# EasyEDA Pro project usbhub.epro

# Schematic Schematic2
Board Name: Board2; Create Date: 2026-05-03; Page Name: P1; Project Name: USB HUB; Schematic Name: Schematic2; Update Date: 2026-05-03; Company: EasyEDA.com; Page Size: A4; Version: V1.0
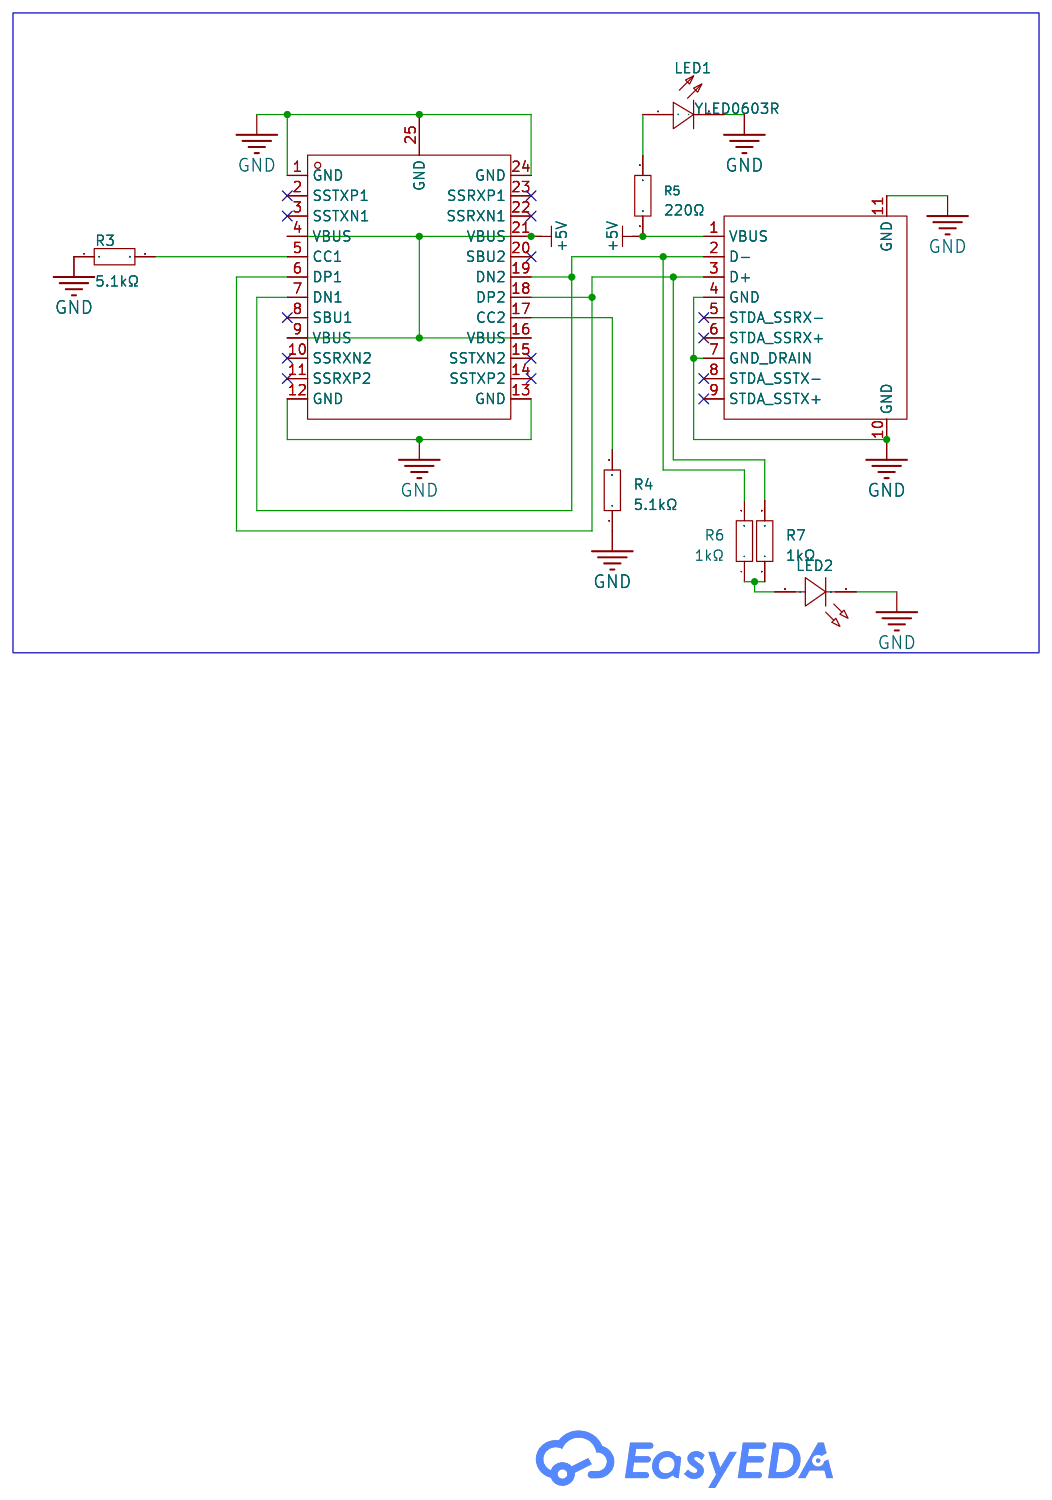
[diagram p0: schematic sheet]

## Parts
LED1  YLED0603R  [LED0603-FD]
LED2  YLED0603Y  [LED0603-RD-1]
R3  5.1kΩ  [R0603]
R4  5.1kΩ  [R0603]
R5  220Ω  [R0603]
R6  1kΩ  [R0402]
R7  1kΩ  [R0402]
U2  HC-USB3.0-C26  [USB-3.0-A-SMD_HC-USB3.0-C26]
USB8  TYPE-C-31-G-08  [USB-C-SMD_TYPE-C-31-G-08]

## Library data of the parts
LED1 = YLED0603R: Lamp Holder Type:-；- Illumination Color:Red Voltage - Forward(Vf):1.8V~2.4V Voltage - Forward(Vf):1.8V~2.4V Power(Watts):- Forward Current:25mA Wavelength - Dominant:620nm~625nm Wavelength - Dominant:620nm~625nm Peak Wavelength:- Diode Configuration:Discr; LCSC Part Name: 红色 独立二极管; Supplier Part: C19171390; Manufacturer: YONGYUTAI(永裕泰); Supplier Footprint: 0603; JLCPCB Part Class: Extended Part; Datasheet: https://item.szlcsc.com/datasheet/YLED0603R/20382441.html; Supplier: LCSC; Lamp Holder Type: -；-; Illumination Color: Red; Voltage - Forward(Vf): 1.8V~2.4V; Forward Current: 25mA; Wavelength - Dominant: 620nm~625nm; Diode Configuration: Discrete Diode; Luminous Intensity: 120mcd; Viewing Angle: 120°; Operating Temperature: -40℃~+85℃
LED2 = YLED0603Y: Lamp Holder Type:- Illumination Color:Yellow Voltage - Forward(Vf):1.8V~2.4V Voltage - Forward(Vf):1.8V~2.4V Power(Watts):- Forward Current:30mA Wavelength - Dominant:585nm~595nm Wavelength - Dominant:585nm~595nm Peak Wavelength:- Diode Configuration:Disc; LCSC Part Name: 黄色 独立二极管; Supplier Part: C19273152; Manufacturer: YONGYUTAI(永裕泰); Supplier Footprint: 0603; JLCPCB Part Class: Extended Part; Datasheet: https://item.szlcsc.com/datasheet/YLED0603Y/20555406.html; Supplier: LCSC; Illumination Color: Yellow; Voltage - Forward(Vf): 1.8V~2.4V; Forward Current: 30mA; Wavelength - Dominant: 585nm~595nm; Diode Configuration: Discrete Diode; Luminous Intensity: 144mcd; Viewing Angle: 120°; Operating Temperature: -40℃~+85℃
R3 R4 = HoAR0603-1/10W-5.1KR-0.1%-TCR25: Type:Ceramic resistor Resistance:5.1kΩ Tolerance:±0.1% Tolerance:±0.1% Power(Watts):1/10W Temperature Coefficient:±25ppm/℃ Temperature Coefficient:±25ppm/℃; LCSC Part Name: 陶瓷电阻 5.1kΩ ±0.1% 100mW; Supplier Part: C5123587; Manufacturer: Milliohm(毫欧); Supplier Footprint: 0603; JLCPCB Part Class: Extended Part; Datasheet: https://item.szlcsc.com/datasheet/HoAR0603-1%252F10W-5.1KR-0.1%2525-TCR25/5717802.html; Supplier: LCSC; Type: Ceramic resistor; Tolerance: ±0.1%; Power(Watts): 1/10W; Temperature Coefficient: ±25ppm/℃
R5 = 0603WAF2200T5E: Type:Thick Film Resistors Resistance: Tolerance:±1% Tolerance:±1% Power(Watts): Overload Voltage (Max): Temperature Coefficient:±100ppm/℃ Temperature Coefficient:±100ppm/℃ Operating Temperature Range:-55℃~+155℃ Operating Temperature Range:-55℃~+155℃; LCSC Part Name: 220Ω ±1% 100mW 厚膜电阻; Supplier Part: C22962; Manufacturer: UNI-ROYAL(厚声); Supplier Footprint: 0603; JLCPCB Part Class: Basic Part; Datasheet: https://atta.szlcsc.com/upload/public/pdf/source/20200306/C422600_1E6D84923E4A46A82E41ADD87F860B5C.pdf; Supplier: LCSC; Type: Thick Film Resistors; Tolerance: ±1%; Temperature Coefficient: ±100ppm/℃; Operating Temperature Range: -55℃~+155℃
R6 R7 = RC0402FR-071KL: Type:Thick Film Resistor Resistance:1kΩ Tolerance:±1% Tolerance:±1% Power(Watts):62.5mW Voltage-Supply(Max):50V Temperature Coefficient:±100ppm/℃ Temperature Coefficient:±100ppm/℃ Operating Temperature:-55℃~+155℃ Operating Temperature:-55℃~+155℃; LCSC Part Name: 厚膜电阻 1kΩ ±1% 62.5mW; Supplier Part: C106235; Manufacturer: YAGEO(国巨); Supplier Footprint: 0402; JLCPCB Part Class: Extended Part; Datasheet: https://item.szlcsc.com/datasheet/RC0402FR-071KL/107450.html; Supplier: LCSC; Type: Thick Film Resistor; Tolerance: ±1%; Power(Watts): 62.5mW; Voltage-Supply(Max): 50V; Temperature Coefficient: ±100ppm/℃; Operating Temperature: -55℃~+155℃
U2 = HC-USB3.0-C26: Connector Type:Type-A Protocol Standard:USB 3.0 Gender:Male Mounting Type:Recessed Mount Number of Contacts:9P Number of Ports:1 Current Rating-Power:1.5A Voltage Rating:30V Connect-Disconnect Life:1,500 Cycles Supplementary Features:- Center Height:- Len; LCSC Part Name: Type-A 公 沉板 USB3.0 A公沉板2.6 直脚中针蓝色 无柱; Supplier Part: C7501854; Manufacturer: HC(虹成电子); Supplier Footprint: SMD; JLCPCB Part Class: Extended Part; Datasheet: https://item.szlcsc.com/datasheet/HC-USB3.0-C26/8585395.html; Supplier: LCSC; Connector Type: Type-A; Protocol Standard: USB 3.0; Gender: Male; Mounting Type: Recessed Mount; Number of Contacts: 9P; Number of Ports: 1; Current Rating-Power: 1.5A; Voltage Rating: 30V; Connect-Disconnect Life: 1,500 Cycles; Length: 18.9mm; Detection color: Blue; Operating Temperature: -25℃~+70℃
USB8 = TYPE-C-31-G-08: Connector Type:Type-C Protocol Standard:- Gender:Male Mounting Type:Laminated board Number of Contacts:24P Number of Ports:1 Current Rating-Power:5A Voltage Rating:5V Connect-Disconnect Life:10,000 cycles Length:15.5mm Detection color:Black Operating Temp; LCSC Part Name: Type-C 公 沉板; Supplier Part: C2909200; Manufacturer: 韩国韩荣; Supplier Footprint: SMD; JLCPCB Part Class: Extended Part; Datasheet: https://item.szlcsc.com/datasheet/TYPE-C-31-G-08/3185965.html; Supplier: LCSC; Connector Type: Type-C; Gender: Male; Mounting Type: Laminated board; Number of Contacts: 24P; Number of Ports: 1; Current Rating-Power: 5A; Voltage Rating: 5V; Connect-Disconnect Life: 10,000 cycles; Length: 15.5mm; Detection color: Black; Operating Temperature: -40℃~+85℃

## Nets
+5V: R5.1 U2.1(VBUS) USB8.4(VBUS) USB8.9(VBUS) USB8.16(VBUS) USB8.21(VBUS)
GND: LED1.2(-) LED2.1(C) R3.1 R4.1 U2.4(GND) U2.7(GND_DRAIN) U2.10(GND) U2.11(GND) USB8.1(GND) USB8.12(GND) USB8.13(GND) USB8.24(GND) USB8.25(GND)
$1N407: R7.2 U2.3(D+) USB8.6(DP1) USB8.18(DP2)
$1N420: R6.2 U2.2(D-) USB8.7(DN1) USB8.19(DN2)
$1N436: R4.2 USB8.17(CC2)
$1N440: R3.2 USB8.5(CC1)
$1N565: LED1.1(+) R5.2
$1N805: LED2.2(A) R6.1 R7.1

Not connected (* = marked no-connect by the designer): U2 5(STDA_SSRX-)* 6(STDA_SSRX+)* 8(STDA_SSTX-)* 9(STDA_SSTX+)*; USB8 2(SSTXP1)* 3(SSTXN1)* 8(SBU1)* 10(SSRXN2)* 11(SSRXP2)* 14(SSTXP2)* 15(SSTXN2)* 20(SBU2)* 22(SSRXN1)* 23(SSRXP1)*

# Schematic Schematic1
Board Name: Board1; Create Date: 2026-05-03; Page Name: P1; Project Name: USB HUB; Schematic Name: Schematic1; Update Date: 2026-05-30; Company: EasyEDA.com; Page Size: A4; Version: V1.0
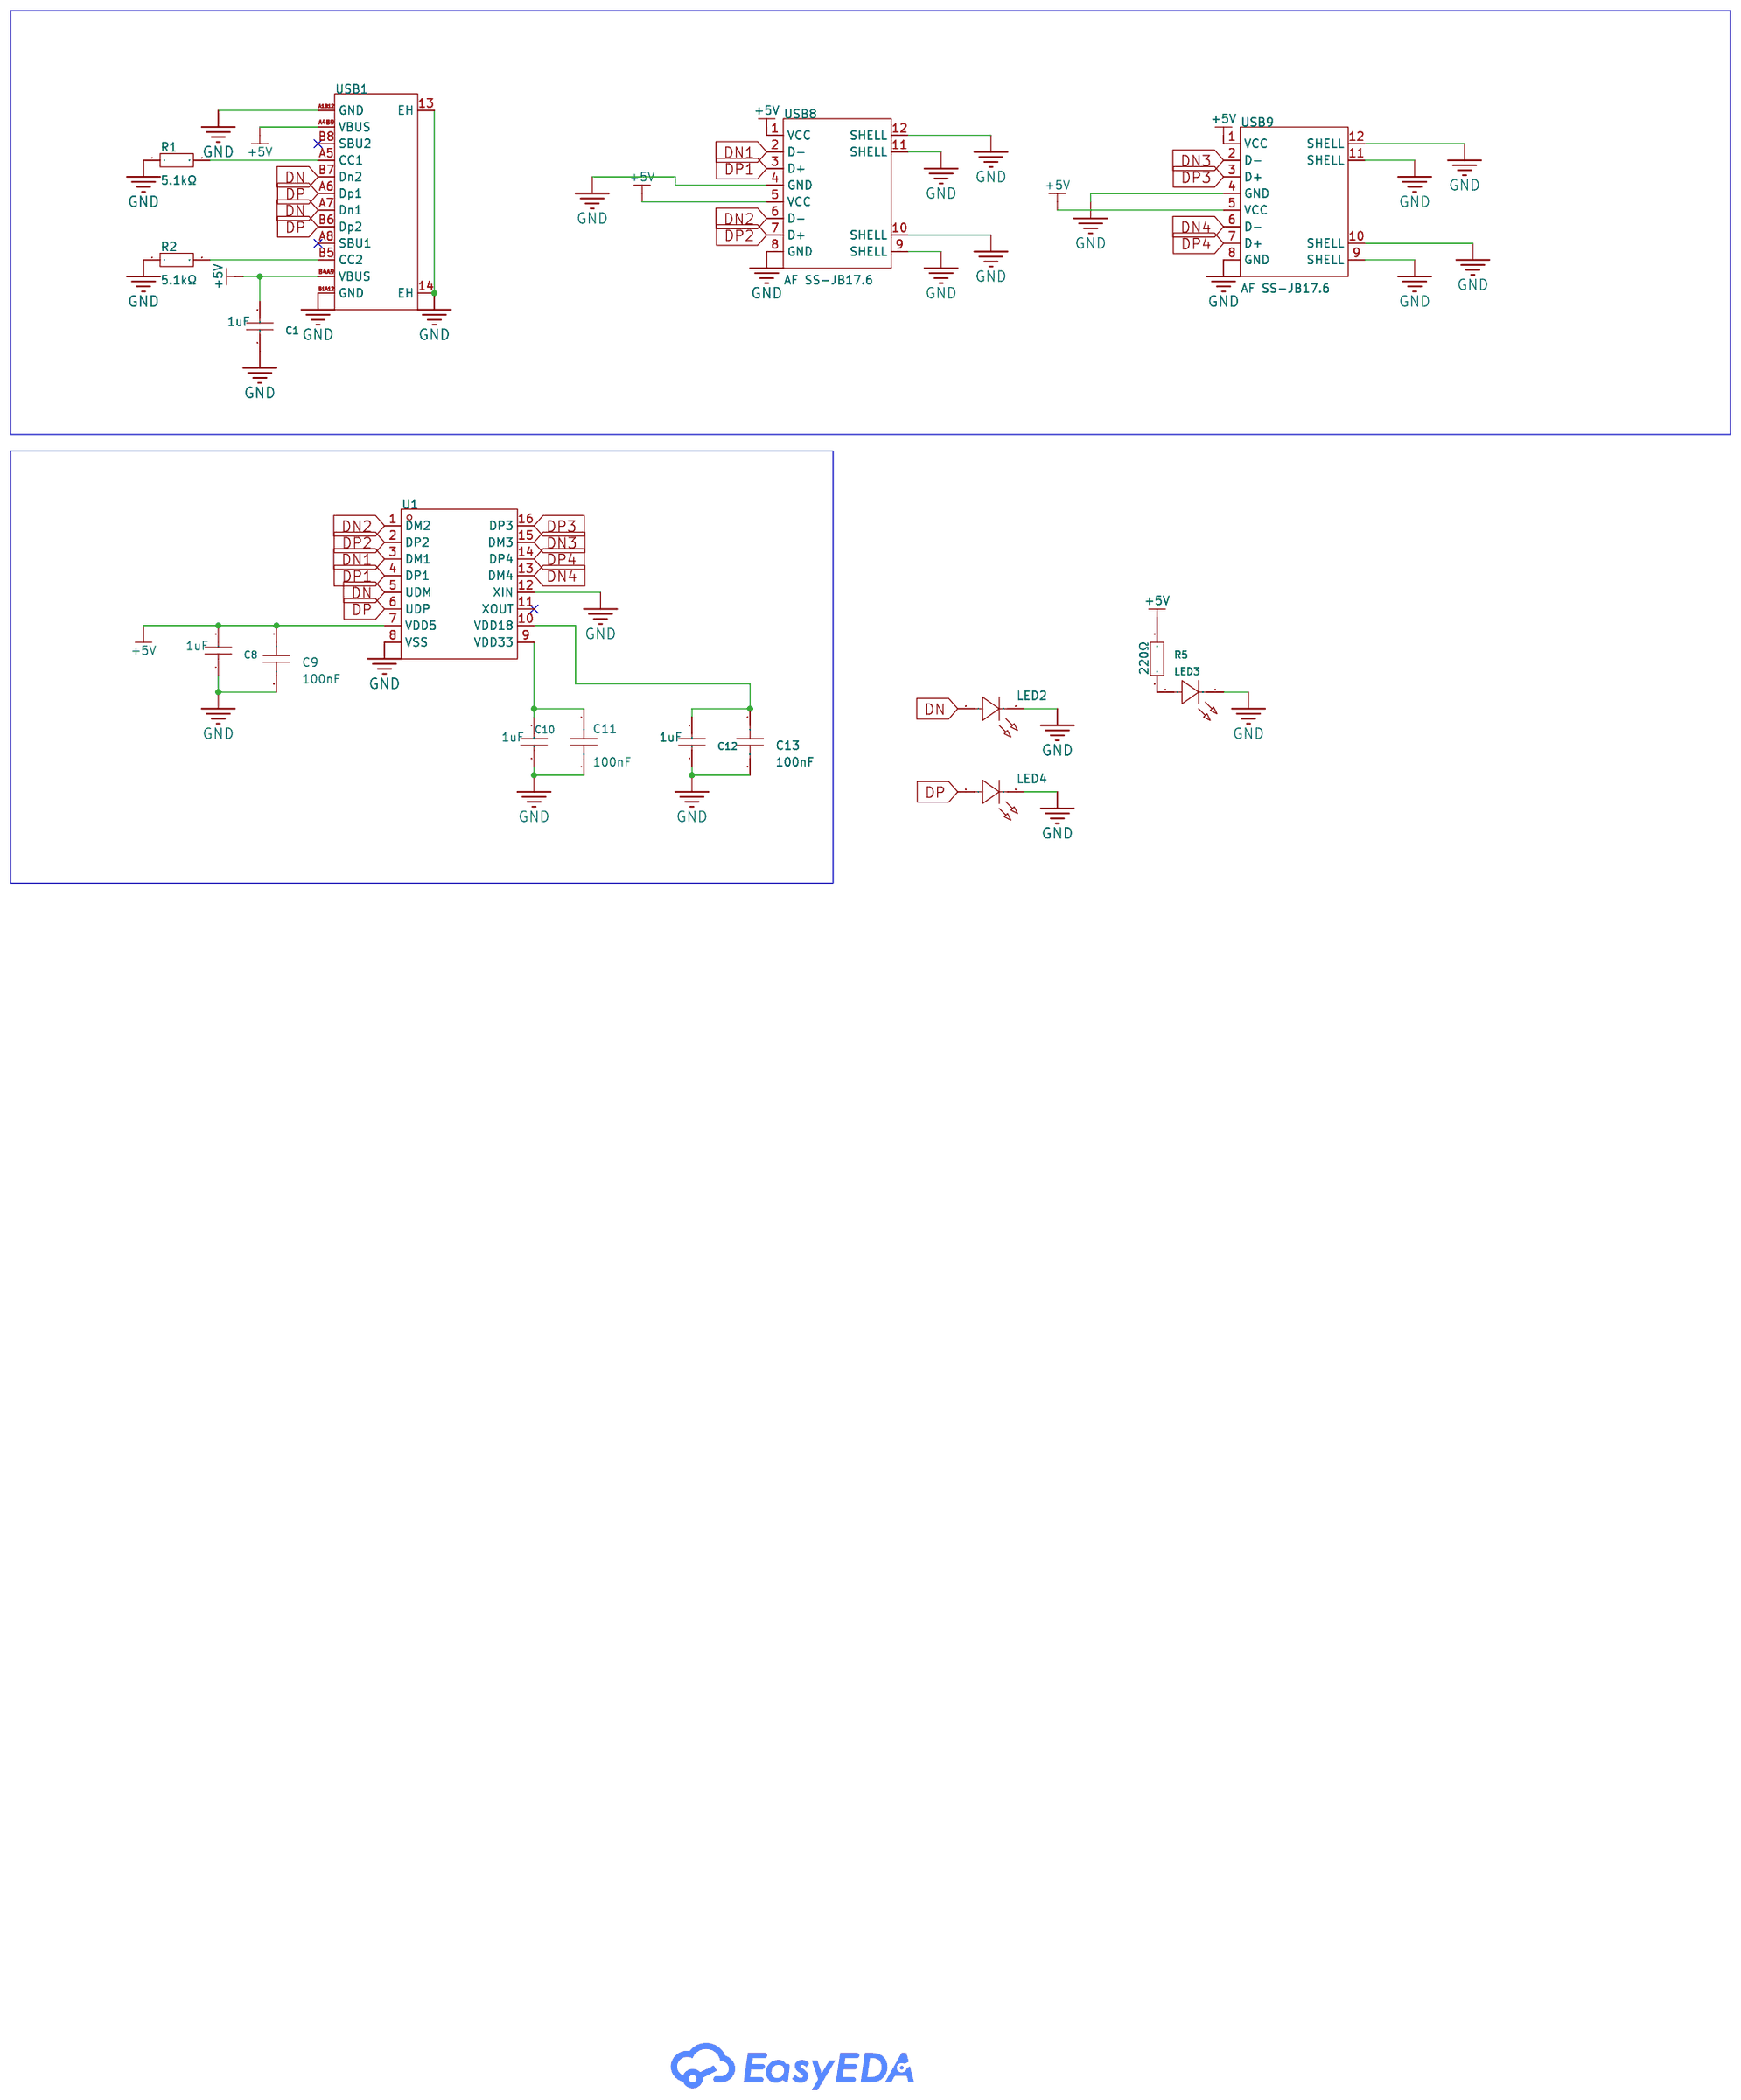
[diagram p1: schematic sheet]

## Parts
C1  1uF  [C0805]
C8  1uF  [C0805]
C9  100nF  [C0603]
C10  1uF  [C0805]
C11  100nF  [C0603]
C12  1uF  [C0805]
C13  100nF  [C0603]
LED2  YLED0603Y  [LED0603-RD-1]
LED3  XL-1608UGC-04  [LED0603-RD_GREEN]
LED4  YLED0603Y  [LED0603-RD-1]
R1  5.1kΩ  [R0603]
R2  5.1kΩ  [R0603]
R5  220Ω  [R0603]
U1  SL2.1s  [SSOP-16_L4.6-W2.6-P0.53-LS4.0-BL]
USB1  TYPE-C 16PIN 2MD(073)  [USB-C-SMD_TYPE-C-16PIN-2MD-073]
USB8  AF SS-JB17.6  [USB-A-TH_AF-SS-JB17.6]
USB9  AF SS-JB17.6  [USB-A-TH_AF-SS-JB17.6]

## Library data of the parts
C1 C8 C10 C12 = CL21B105KBFNNNE: Capacitance:1uF Tolerance:±10% Tolerance:±10% Voltage Rating:50V Temperature Coefficient:X7R; LCSC Part Name: 1uF ±10% 50V; Supplier Part: C28323; Manufacturer: SAMSUNG(三星); Supplier Footprint: 0805; JLCPCB Part Class: Basic Part; Datasheet: https://item.szlcsc.com/datasheet/CL21B105KBFNNNE/29074.html; Supplier: LCSC; Tolerance: ±10%; Voltage Rating: 50V; Temperature Coefficient: X7R
C9 C11 C13 = CC0603KRX7R9BB104: Capacitance:100nF Tolerance:±10% Tolerance:±10% Voltage Rating:50V Temperature Coefficient:X7R; LCSC Part Name: 100nF ±10% 50V; Supplier Part: C14663; Manufacturer: YAGEO(国巨); Supplier Footprint: 0603; JLCPCB Part Class: Basic Part; Datasheet: https://item.szlcsc.com/datasheet/CC0603KRX7R9BB104/15331.html; Supplier: LCSC; Tolerance: ±10%; Voltage Rating: 50V; Temperature Coefficient: X7R
LED2 LED4 = YLED0603Y: Lamp Holder Type:- Illumination Color:Yellow Voltage - Forward(Vf):1.8V~2.4V Voltage - Forward(Vf):1.8V~2.4V Power(Watts):- Forward Current:30mA Wavelength - Dominant:585nm~595nm Wavelength - Dominant:585nm~595nm Peak Wavelength:- Diode Configuration:Disc; LCSC Part Name: 黄色 独立二极管; Supplier Part: C19273152; Manufacturer: YONGYUTAI(永裕泰); Supplier Footprint: 0603; JLCPCB Part Class: Extended Part; Datasheet: https://item.szlcsc.com/datasheet/YLED0603Y/20555406.html; Supplier: LCSC; Illumination Color: Yellow; Voltage - Forward(Vf): 1.8V~2.4V; Forward Current: 30mA; Wavelength - Dominant: 585nm~595nm; Diode Configuration: Discrete Diode; Luminous Intensity: 144mcd; Viewing Angle: 120°; Operating Temperature: -40℃~+85℃
LED3 = XL-1608UGC-04: Lamp Holder Type:- Illumination Color:Emerald Green Voltage - Forward(Vf):3.3V Voltage - Forward(Vf):3.3V Power(Watts):70mW Forward Current:20mA Wavelength - Dominant:515nm~535nm Wavelength - Dominant:515nm~535nm Peak Wavelength:525nm Diode Configuration:; LCSC Part Name: 0603翠绿贴片式发光二极管; Supplier Part: C965804; Manufacturer: XINGLIGHT(成兴光); Supplier Footprint: 0603; JLCPCB Part Class: Extended Part; Datasheet: https://item.szlcsc.com/datasheet/XL-1608UGC-04/1051413.html; Supplier: LCSC; Illumination Color: Emerald Green; Voltage - Forward(Vf): 3.3V; Power(Watts): 70mW; Forward Current: 20mA; Wavelength - Dominant: 515nm~535nm; Peak Wavelength: 525nm; Diode Configuration: Discrete Diode; Lens Color: Water Clear; Luminous Intensity: 810mcd; Viewing Angle: 120°; Mounting Style: Top-mount; Operating Temperature: -40℃~+85℃
R1 R2 = HoAR0603-1/10W-5.1KR-0.1%-TCR25: Type:Ceramic resistor Resistance:5.1kΩ Tolerance:±0.1% Tolerance:±0.1% Power(Watts):1/10W Temperature Coefficient:±25ppm/℃ Temperature Coefficient:±25ppm/℃; LCSC Part Name: 陶瓷电阻 5.1kΩ ±0.1% 100mW; Supplier Part: C5123587; Manufacturer: Milliohm(毫欧); Supplier Footprint: 0603; JLCPCB Part Class: Extended Part; Datasheet: https://item.szlcsc.com/datasheet/HoAR0603-1%252F10W-5.1KR-0.1%2525-TCR25/5717802.html; Supplier: LCSC; Type: Ceramic resistor; Tolerance: ±0.1%; Power(Watts): 1/10W; Temperature Coefficient: ±25ppm/℃
R5 = 0603WAF2200T5E: Type:Thick Film Resistors Resistance: Tolerance:±1% Tolerance:±1% Power(Watts): Overload Voltage (Max): Temperature Coefficient:±100ppm/℃ Temperature Coefficient:±100ppm/℃ Operating Temperature Range:-55℃~+155℃ Operating Temperature Range:-55℃~+155℃; LCSC Part Name: 220Ω ±1% 100mW 厚膜电阻; Supplier Part: C22962; Manufacturer: UNI-ROYAL(厚声); Supplier Footprint: 0603; JLCPCB Part Class: Basic Part; Datasheet: https://atta.szlcsc.com/upload/public/pdf/source/20200306/C422600_1E6D84923E4A46A82E41ADD87F860B5C.pdf; Supplier: LCSC; Type: Thick Film Resistors; Tolerance: ±1%; Temperature Coefficient: ±100ppm/℃; Operating Temperature Range: -55℃~+155℃
U1 = SL2.1s: type:Hub USB Protocol:USB 2.0 Data Rate:- Voltage - Supply:4V~5.25V Voltage - Supply:4V~5.25V Operating Temperature:0℃~+70℃ Operating Temperature:0℃~+70℃ Memory Interface:- Current - Supply:120mA Quiescent Supply Current:2.5mA Number of Channels:4; LCSC Part Name: USB2.0 HUB控制器集成电路; Supplier Part: C2684433; Manufacturer: CoreChips(和芯润德); Supplier Footprint: SSOP-16; JLCPCB Part Class: Extended Part; Datasheet: https://item.szlcsc.com/datasheet/SL2.1s/2782346.html; Supplier: LCSC; type: Hub; USB Protocol: USB 2.0; Voltage - Supply: 4V~5.25V; Operating Temperature: 0℃~+70℃; Current - Supply: 120mA; Quiescent Supply Current: 2.5mA; Number of Channels: 4
USB1 = TYPE-C 16PIN 2MD(073): Connector Type:Type-C Protocol Standard:- Gender:Female Mounting Type:Surface Mount, Right Angle Number of Contacts:16P Number of Ports:1 Current Rating-Power:3A Voltage Rating:5V Connect-Disconnect Life:10,000 Cycles Supplementary Features:- Center Heigh; LCSC Part Name: Type-C 母 卧贴; Supplier Part: C2765186; Manufacturer: SHOU HAN(首韩); Supplier Footprint: SMD; JLCPCB Part Class: Extended Part; Datasheet: https://item.szlcsc.com/datasheet/TYPE-C%252016PIN%25202MD(073)/2901843.html; Supplier: LCSC; Connector Type: Type-C; Gender: Female; Mounting Type: Surface Mount, Right Angle; Number of Contacts: 16P; Number of Ports: 1; Current Rating-Power: 3A; Voltage Rating: 5V; Connect-Disconnect Life: 10,000 Cycles; Detection color: Black; Operating Temperature: -25℃~+85℃
USB8 USB9 = AF SS-JB17.6: Connector Type:Type-A Protocol Standard:USB 2.0 Gender:Female Mounting Type:Right Angle Number of Contacts:4Px2 Number of Ports:2 Current Rating-Power:1.5A Voltage Rating:30V Connect-Disconnect Life:5,000 times Supplementary Features:- Center Height:- Len; LCSC Part Name: Type-A弯插双层母座; Supplier Part: C456021; Manufacturer: SHOU HAN(首韩); Supplier Footprint: 弯插; JLCPCB Part Class: Extended Part; Datasheet: https://item.szlcsc.com/datasheet/AF%2520SS-JB17.6/458828.html; Supplier: LCSC; Connector Type: Type-A; Protocol Standard: USB 2.0; Gender: Female; Mounting Type: Right Angle; Number of Contacts: 4Px2; Number of Ports: 2; Current Rating-Power: 1.5A; Voltage Rating: 30V; Connect-Disconnect Life: 5,000 times; Length: 17.6mm; Detection color: White; Operating Temperature: -25℃~+85℃

## Nets
+5V: C1.2 C8.2 C9.1 R5.2 U1.7(VDD5) USB1.A4B9(VBUS) USB1.B4A9(VBUS) USB8.1(VCC) USB8.5(VCC) USB9.1(VCC) USB9.5(VCC)
GND: C1.1 C8.1 C9.2 C10.1 C11.2 C12.1 C13.2 LED2.1(C) LED3.1(K) LED4.1(C) R1.1 R2.1 U1.8(VSS) U1.12(XIN) USB1.13(EH) USB1.14(EH) USB1.A1B12(GND) USB1.B1A12(GND) USB8.4(GND) USB8.8(GND) USB8.9(SHELL) USB8.10(SHELL) USB8.11(SHELL) USB8.12(SHELL) USB9.4(GND) USB9.8(GND) USB9.9(SHELL) USB9.10(SHELL) USB9.11(SHELL) USB9.12(SHELL)
DN: LED2.2(A) U1.5(UDM) USB1.A7(Dn1) USB1.B7(Dn2)
DN1: U1.3(DM1) USB8.2(D-)
DN2: U1.1(DM2) USB8.6(D-)
DN3: U1.15(DM3) USB9.2(D-)
DN4: U1.13(DM4) USB9.6(D-)
DP: LED4.2(A) U1.6(UDP) USB1.A6(Dp1) USB1.B6(Dp2)
DP1: U1.4(DP1) USB8.3(D+)
DP2: U1.2(DP2) USB8.7(D+)
DP3: U1.16(DP3) USB9.3(D+)
DP4: U1.14(DP4) USB9.7(D+)
$1N863: R1.2 USB1.A5(CC1)
$1N889: R2.2 USB1.B5(CC2)
$1N3801: C10.2 C11.1 U1.9(VDD33)
$1N3815: C12.2 C13.1 U1.10(VDD18)
$1N6307: LED3.2(A) R5.1

Not connected (* = marked no-connect by the designer): U1 11(XOUT)*; USB1 A8(SBU1)* B8(SBU2)*

# Board PCB3
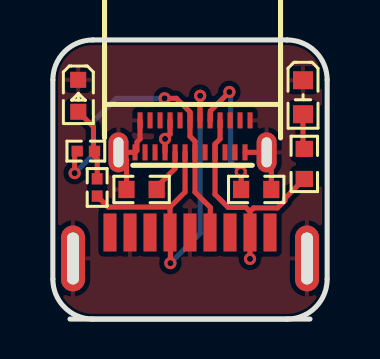
[diagram p2: board, top side]
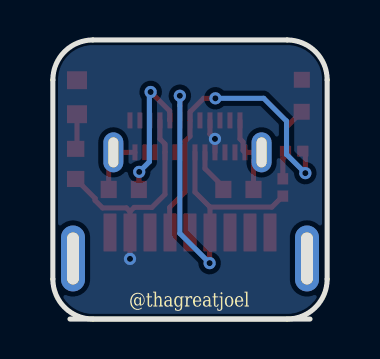
[diagram p3: board, bottom side, seen from below]

Outline 13.72 x 13.97 mm; copper layers: Top Layer, Bottom Layer. Coordinates in mm from the lower left corner of the outline.
Outline path: 0,11.97 0,2 arc(0.59,0.59) 2,0 11.72,0 arc(13.13,0.59) 13.72,2 13.72,11.97 arc(13.13,13.38) 11.72,13.97 2,13.97 arc(0.59,13.38) 0,11.97
Stack: Top Layer 0.035mm / Dielectric1 1.51mm FR4 er 4.5 / Bottom Layer 0.035mm

## Design rules (mm)
template: JLCPCB Capability(Two Layers Board)
spacing copperThickness1oz (default): track to track 0.102, other pairs 0.152 to 0.3
spacing copperThickness2oz: track to track 0.203, other pairs 0.152 to 0.3
track width copperThickness1oz (default): min 0.127, default 0.254, max 2.54
track width copperThickness2oz: min 0.203, default 0.254, max 2.54
differential pair differentialPair (default): width min 0.127, default 0.254, max 2.54; gap min 0.152, default 0.152
via viaSize (default): diameter min 0.5, default 0.61, max 10; hole min 0.3, default 0.305, max 6.3

## Placement (name value [footprint] x y rotation side)
LED1  YLED0603R  [LED0603-FD]  12.51 11.1 90 top
LED2  YLED0603Y  [LED0603-RD-1]  1.27 11.18 270 top
R3  5.1kΩ  [R0603]  4.44 6.49 0 top
R4  5.1kΩ  [R0603]  10.17 6.49 180 top
R5  220Ω  [R0603]  12.57 7.76 90 top
R6  1kΩ  [R0402]  1.65 8.41 180 top
R7  1kΩ  [R0402]  2.22 6.59 270 top
U2  HC-USB3.0-C26  [USB-3.0-A-SMD_HC-USB3.0-C26]  6.86 3.68 0 top
USB8  TYPE-C-31-G-08  [USB-C-SMD_TYPE-C-31-G-08]  6.98 9.14 180 top

## Footprints (pads in the part's own frame, mm; a bottom-side part is the same pattern mirrored in y, then rotated)
LED0603-FD
  rect 0.9x1 smd: 1(-0.85,0) 2(0.85,0)
LED0603-RD-1
  rect 0.8x0.8 smd: 1(-0.799,-0.004) 2(0.799,0.004)
R0402
  rect 0.566x0.54 smd: 1(-0.433,0) 2(0.433,0)
R0603
  rect 0.806x0.864 smd: 1(-0.753,0) 2(0.753,0)
USB-3.0-A-SMD_HC-USB3.0-C26
  rect 0.65x1.9 smd: 1(3,0.65) 2(1,0.65) 3(-1,0.65) 4(-3,0.65) 5(-4,0.65) 6(-2,0.65) 7(0,0.65) 8(2,0.65) 9(4,0.65)
  oval 1.2x3.3 hole 0.6x2.6: 10(-5.85,-0.65) 11(5.85,-0.65)
USB-C-SMD_TYPE-C-31-G-08
  rect 0.25x0.8 smd: 1(2.875,0.8) 2(2.375,0.8) 3(1.875,0.8) 4(1.375,0.8) 5(0.875,0.8) 6(0.375,0.8) 7(-0.125,0.8) 8(-0.625,0.8) 9(-1.125,0.8) 10(-1.625,0.8) 11(-2.125,0.8) 12(-2.625,0.8) 13(-2.875,-0.8) 14(-2.375,-0.8) 15(-1.875,-0.8) 16(-1.375,-0.8) 17(-0.875,-0.8) 18(-0.375,-0.8) 19(0.125,-0.8) 20(0.625,-0.8) 21(1.125,-0.8) 22(1.625,-0.8) 23(2.125,-0.8) 24(2.625,-0.8)
  oval 1x2 hole 0.5x1.5: 25(-3.705,0.8) 25(3.705,0.8)

## Nets
As in the schematic.

Pads without a net: U2 5 6 8 9; USB8 2 3 8 10 11 14 15 20 22 23

## Via types
v1: diameter 0.61, hole 0.305, Top Layer to Bottom Layer, 8 vias

## Routing (per net, layer and track width the routed paths; a pad name or vN(x,y) marks a point on that pad's centre or on a via; arc(x,y) is an arc through that point)
+5V: length 13.4
  Top Layer w0.254: 9.86,5.38 10.04,5.56 11.23,5.56 11.6,5.94 11.6,6.04 R5.1 ; 9.86,5.38 9.65,5.59 8.76,5.59 8.11,6.24 USB8.9 8.11,8.76 8.36,9.01 USB8.16 ; 9.86,5.38 v1(9.86,3.01) ; USB8.4 v1(5.61,9.02) 5.85,9.25 5.86,9.25 USB8.21
GND: length 7.6
  Top Layer w0.254: USB8.24 4.36,9.01 4.21,8.86 4.21,8.44 USB8.1 USB8.25 3.68,7.94 R3.1 ; R4.1 10.92,8.11 USB8.25 USB8.12
$1N407: length 20
  Top Layer w0.254: 5.86,5.6 2.77,5.6 2.22,6.15 ; 5.86,5.6 6.61,6.36 USB8.6 ; 5.86,5.6 5.86,4.33 5.88,4.31 v1(5.88,2.8) ; v1(7.37,11.18) 7.37,10.68 7.36,10.67 USB8.18
  Bottom Layer w0.254: v1(5.88,2.8) 7.37,4.29 v1(7.37,11.18)
$1N420: length 16.2
  Top Layer w0.254: v1(1.09,7.3) 1.09,8.28 R6.2 ; v1(5.59,11.05) 6.17,11.05 6.86,10.36 USB8.19 6.86,9.94 6.86,9.14 7.11,8.89 USB8.7 7.11,6.35 7.87,5.59 7.87,4.35 7.86,4.33
  Bottom Layer w0.254: v1(1.09,7.3) 2.03,8.24 2.03,9.91 3.17,11.05 v1(5.59,11.05)
$1N436: length 6.9
  Top Layer w0.254: v1(9.4,7.37) 9.42,7.35 R4.2 ; USB8.17 7.87,9.96 7.87,10.41 v1(8.83,11.37)
  Bottom Layer w0.254: v1(8.83,11.37) 8.89,11.3 8.89,7.87 v1(9.4,7.37)
$1N440: length 2.1
  Top Layer w0.254: 5.19,6.61 6.11,7.53 USB8.5
$1N565: length 1.8
  Top Layer w0.254: R5.2 12.51,8.58 LED1.1
$1N805: length 3.7
  Top Layer w0.254: R7.1 2.22,8.02 2.03,8.2 2.03,9.62 LED2.2

## Copper pours and planes (outline as drawn; the poured copper is in the pictures)
+5V on Bottom Layer: -10.41,15.88 17.4,15.88 17.4,-6.48 -10.41,-6.48
GND on Top Layer: -2.41,19.3 20.07,19.3 20.07,-2.92 -2.41,-2.92

## Text on the board
Bottom Silkscreen Layer: @thagreatjoel

# Board PCB1
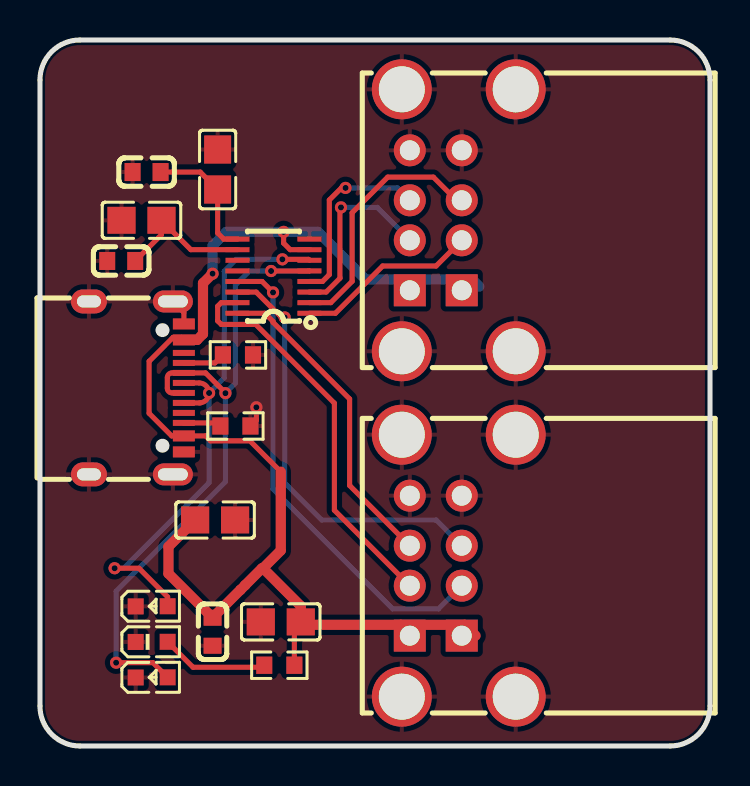
[diagram p4: board, top side]
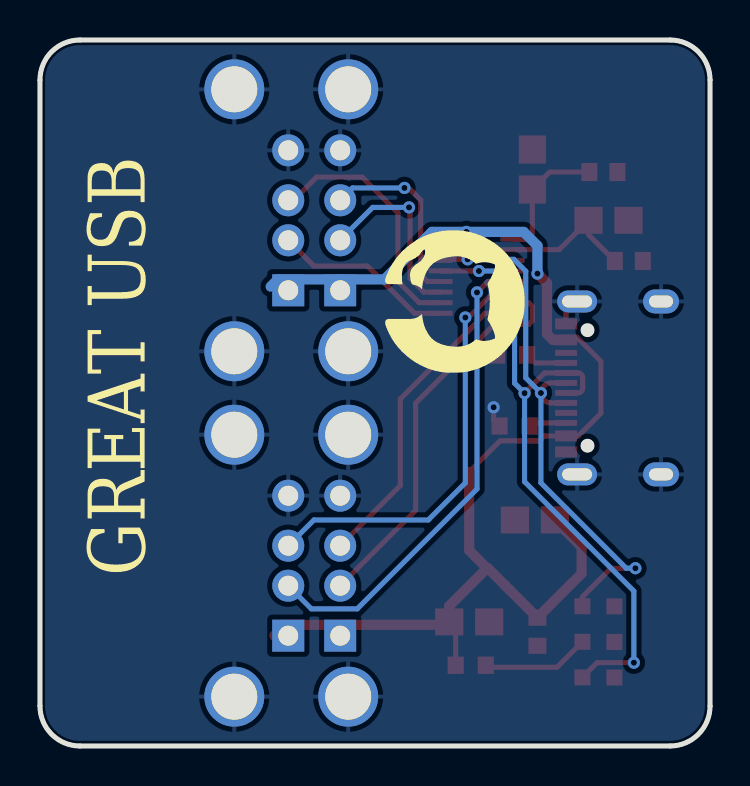
[diagram p5: board, bottom side, seen from below]

Outline 33.53 x 35.31 mm; copper layers: Top Layer, Bottom Layer. Coordinates in mm from the lower left corner of the outline.
Outline path: 0,33.31 0,2 arc(0.59,0.59) 2,0 31.53,0 arc(32.94,0.59) 33.53,2 33.53,33.31 arc(32.94,34.72) 31.53,35.31 2,35.31 arc(0.59,34.72) 0,33.31
Stack: Top Layer 0.035mm / Dielectric1 1.51mm FR4 er 4.5 / Bottom Layer 0.035mm

## Design rules (mm)
template: JLCPCB Capability(Two Layers Board)
spacing copperThickness1oz (default): track to track 0.102, other pairs 0.152 to 0.3
spacing copperThickness2oz: track to track 0.203, other pairs 0.152 to 0.3
track width copperThickness1oz (default): min 0.127, default 0.254, max 2.54
track width copperThickness2oz: min 0.203, default 0.254, max 2.54
differential pair differentialPair (default): width min 0.127, default 0.254, max 2.54; gap min 0.152, default 0.152
via viaSize (default): diameter min 0.5, default 0.61, max 10; hole min 0.3, default 0.305, max 6.3

## Placement (name value [footprint] x y rotation side)
C1  1uF  [C0805]  8.76 11.3 180 top
C8  1uF  [C0805]  12.05 6.21 0 top
C9  100nF  [C0603]  8.64 5.72 270 top
C10  1uF  [C0805]  8.89 28.83 270 top
C11  100nF  [C0603]  5.33 28.7 180 top
C12  1uF  [C0805]  5.08 26.29 0 top
C13  100nF  [C0603]  4.06 24.26 180 top
LED2  YLED0603Y  [LED0603-RD-1]  5.59 3.43 0 top
LED3  XL-1608UGC-04  [LED0603-RD_GREEN]  5.59 5.21 0 top
LED4  YLED0603Y  [LED0603-RD-1]  5.59 6.98 0 top
R1  5.1kΩ  [R0603]  9.91 19.56 180 top
R2  5.1kΩ  [R0603]  9.78 16 180 top
R5  220Ω  [R0603]  11.98 4.04 0 top
U1  SL2.1s  [SSOP-16_L4.6-W2.6-P0.53-LS4.0-BL]  11.68 23.5 90 top
USB1  TYPE-C 16PIN 2MD(073)  [USB-C-SMD_TYPE-C-16PIN-2MD-073]  4.83 17.91 270 top
USB8  AF SS-JB17.6  [USB-A-TH_AF-SS-JB17.6]  20.96 26.29 90 top
USB9  AF SS-JB17.6  [USB-A-TH_AF-SS-JB17.6]  20.96 9.02 90 top

## Footprints (pads in the part's own frame, mm; a bottom-side part is the same pattern mirrored in y, then rotated)
C0603
  rect 0.8x0.9 smd: 1(-0.7,0) 2(0.7,0)
C0805
  rect 1.41x1.35 smd: 1(-1,0) 2(1,0)
LED0603-RD-1
  rect 0.8x0.8 smd: 1(-0.799,-0.004) 2(0.799,0.004)
LED0603-RD_GREEN
  rect 0.8x0.8 smd: 1(-0.799,-0.004) 2(0.799,0.004)
R0603
  rect 0.806x0.864 smd: 1(-0.753,0) 2(0.753,0)
SSOP-16_L4.6-W2.6-P0.53-LS4.0-BL
  rect 0.25x1.2 smd: 1(-1.855,-1.8) 2(-1.325,-1.8) 3(-0.795,-1.8) 4(-0.265,-1.8) 5(0.265,-1.8) 6(0.795,-1.8) 7(1.325,-1.8) 8(1.855,-1.8) 9(1.855,1.8) 10(1.325,1.8) 11(0.795,1.8) 12(0.265,1.8) 13(-0.265,1.8) 14(-0.795,1.8) 15(-1.325,1.8) 16(-1.855,1.8)
USB-A-TH_AF-SS-JB17.6
  rect 1.6x1.6 hole 1: 1(-3.5,2.45) 5(-3.5,-0.15)
  round 1.6 hole 1: 2(-1,2.45) 3(1,2.45) 4(3.5,2.45) 6(-1,-0.15) 7(1,-0.15) 8(3.5,-0.15)
  round 3 hole 2.3: 9(-6.55,2.85) 10(6.55,2.85) 11(-6.55,-2.85) 12(6.55,-2.85)
USB-C-SMD_TYPE-C-16PIN-2MD-073
  oval 1.1x2 hole 0.6x1.5: 13(-4.325,1.825) 14(4.325,1.825)
  oval 1.2x1.8 hole 0.6x1.2: 13(-4.325,-2.375) 14(4.325,-2.375)
  rect 0.55x1.1 smd: A1B12(-3.2,2.375) A4B9(-2.4,2.375) B1A12(3.2,2.375) B4A9(2.4,2.375)
  rect 0.3x1.1 smd: A5(-1.25,2.375) A6(-0.25,2.375) A7(0.25,2.375) A8(1.25,2.375) B5(1.75,2.375) B6(0.75,2.375) B7(-0.75,2.375) B8(-1.75,2.375)

## Nets
As in the schematic.

Pads without a net: U1 11; USB1 A8 B8

## Via types
v1: diameter 0.61, hole 0.305, Top Layer to Bottom Layer, 13 vias

## Routing (per net, layer and track width the routed paths; a pad name or vN(x,y) marks a point on that pad's centre or on a via; arc(x,y) is an arc through that point)
+5V: length 66.3
  Top Layer w0.254: USB1.A4B9 7.07,20.43 6.66,20.43 5.46,19.24 5.46,16.64 6.59,15.51 USB1.B4A9 8.29,15.51 8.54,15.26 10.5,15.26 12.05,13.72 ; v1(12.19,25.71) 12.19,25.15 12.52,24.82 U1.7 ; C8.2 12.73,5.89 R5.2
  Top Layer w0.508: 12.05,13.72 12.05,9.78 11.16,8.89 ; 11.16,8.89 11.11,8.89 10.27,8.05 10.27,8.05 10.03,7.81 10.03,7.81 C9.1 6.43,8.62 6.43,9.97 C1.2 ; 11.16,8.89 13.05,7 C8.2 13.19,6.06 18.05,6.06 ; v1(8.64,23.62) 8.16,23.14 8.16,20.6 7.86,20.31 USB1.A4B9 ; 18.05,6.06 18.6,5.52 ; 18.05,6.06 21.25,6.06 21.8,5.52
  Bottom Layer w0.508: 21.98,22.97 21.62,23.33 18.6,23.33 ; 18.6,23.33 16.29,23.33 13.91,25.71 v1(12.19,25.71) 9.33,25.71 8.64,25.02 v1(8.64,23.62) ; 18.6,23.33 18.6,22.79
GND: length 2.4
  Top Layer w0.254: v1(10.83,16.94) 10.83,16.3 R2.1 ; 6.65,22.23 7.2,21.68 USB1.A1B12
DN: length 33.2
  Top Layer w0.254: LED2.2 5.65,4.17 v1(3.81,4.17) ; U1.5 13.48,23.75 v1(11.56,23.75) ; USB1.A7 6.61,17.66 arc(6.44,17.73) 6.37,17.89 6.37,18.42 arc(6.44,18.59) 6.61,18.66 USB1.B7 8.28,18.66 9.28,17.66 v1(9.28,17.64)
  Bottom Layer w0.254: v1(3.81,4.17) 3.81,7.75 9.28,13.22 v1(9.28,17.64) 9.78,18.14 9.78,23.06 10.47,23.75 v1(11.56,23.75)
DN1: length 9.5
  Top Layer w0.254: U1.3 14.32,22.7 15.01,23.39 15.01,26.78 15.06,26.83 v1(15.06,26.94)
  Bottom Layer w0.254: 18.5,25.29 18.5,25.31 16.88,26.94 v1(15.06,26.94)
DN2: length 9.1
  Top Layer w0.254: USB8.6 19.82,24 17.15,24 14.78,21.64 U1.1
DN3: length 20
  Top Layer w0.254: 18.5,8.02 14.73,11.79 14.73,17.14 10.8,21.08 9.07,21.08 8.89,21.26 8.89,21.99 9.07,22.17 U1.15
DN4: length 24.2
  Top Layer w0.254: U1.13 11.11,23.23 v1(11.66,22.68)
  Bottom Layer w0.254: USB9.6 19.95,6.86 17.65,6.86 11.66,12.85 v1(11.66,22.68)
DP: length 28.7
  Top Layer w0.254: USB1.A6 7.96,18.16 arc(8.31,18.01) v1(8.46,17.65) arc(8.46,17.62) 8.46,17.58 arc(8.32,17.3) 8.04,17.16 arc(8,17.16) 7.97,17.16 USB1.B6 ; v1(12.13,24.34) 13.44,24.34 U1.6 ; v1(3.74,8.89) 4.95,8.89 6.39,7.46 LED4.2
  Bottom Layer w0.254: v1(12.13,24.34) 9.81,24.34 9.22,23.74 9.22,18.41 v1(8.46,17.65) 8.46,13.16 4.19,8.89 v1(3.74,8.89)
DP1: length 9.4
  Top Layer w0.254: v1(15.29,27.91) 15.08,27.91 14.48,27.3 14.48,23.57 14.14,23.23 U1.4
  Bottom Layer w0.254: v1(15.29,27.91) 17.89,27.91 18.5,27.29
DP2: length 12.7
  Top Layer w0.254: U1.2 14.55,22.17 15.62,23.24 15.62,26.67 17.4,28.45 19.69,28.45 20.84,27.29 USB8.7
DP3: length 16
  Top Layer w0.254: 18.5,10.02 15.49,13.03 15.49,17.36 11.66,21.19 11.66,21.23 11.25,21.64 U1.16
DP4: length 21.3
  Top Layer w0.254: U1.14 10.82,22.7 12.09,21.43 v1(12.25,21.43)
  Bottom Layer w0.254: v1(12.25,21.43) 12.25,13.16 14.1,11.3 19.82,11.3 USB9.7
$1N863: length 2.1
  Top Layer w0.254: R1.2 8.75,19.16 USB1.A5
$1N889: length 1.9
  Top Layer w0.254: R2.2 8.87,16.16 USB1.B5
$1N3801: length 6.5
  Top Layer w0.254: 9.88,25.35 9.19,25.35 8.89,25.65 C10.2 8.02,28.7 C11.1
$1N3815: length 7
  Top Layer w0.254: C13.1 6.08,25.57 C12.2 7.55,24.82 U1.10
$1N6307: length 5.4
  Top Layer w0.254: LED3.2 7.66,3.94 11.12,3.94 R5.1

## Copper pours and planes (outline as drawn; the poured copper is in the pictures)
GND on Top Layer: -1.27,40.64 36.19,40.64 36.19,-2.41 -1.27,-2.41
GND on Bottom Layer: -1.91,38.99 37.47,38.99 37.47,-3.17 -1.91,-3.17

## Text on the board
Bottom Silkscreen Layer: GREAT USB
